# Altium schematic sheet MCU - IMU.SchDoc
size A4; SheetNumber: 5; SheetTotal: 8
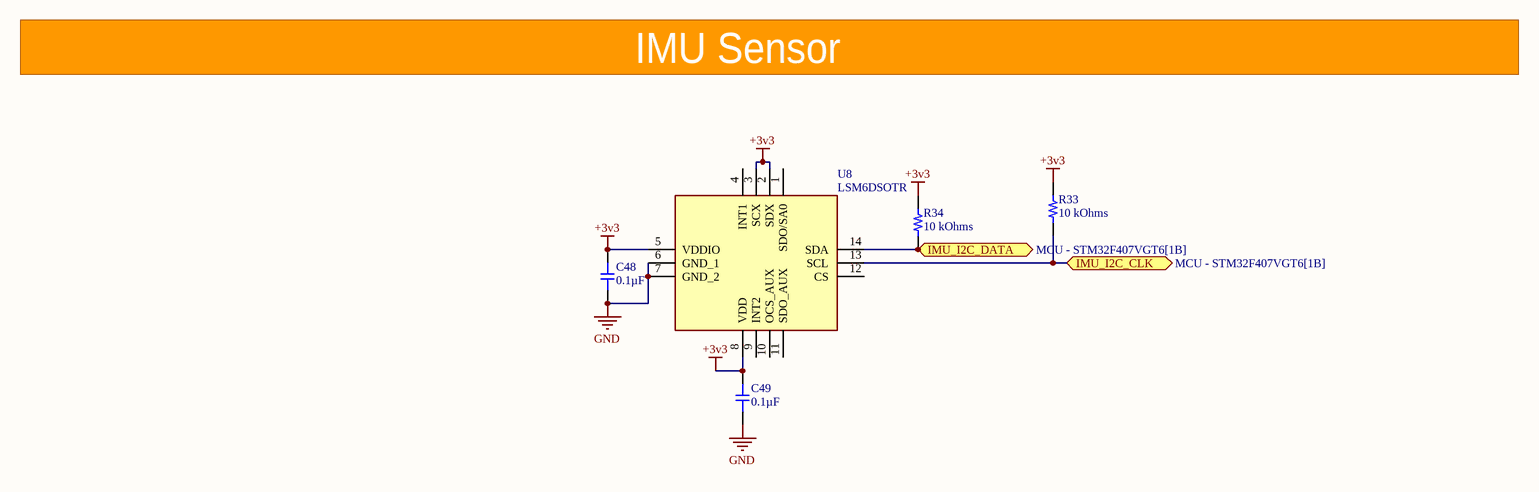
[diagram p0: MCU - IMU.SchDoc]

## Parts
C48  0.1µF  [0603_Footprint]
C49  0.1µF  [0603_Footprint]
R33  10 kOhms  [0603_RES]
R34  10 kOhms  [0603_RES]
U8  LSM6DSOTR  [LGA-14(2.5X3X0.86)]

## Ports
IMU_I2C_CLK (bidir, see MCU - STM32F407VGT6[1B]), IMU_I2C_DATA (bidir, see MCU - STM32F407VGT6[1B])

## Nets
+3v3: C48.1 C49.1 R33.1 R34.2 U8.2(SDX) U8.3(SCX) U8.5(VDDIO) U8.8(VDD)
GND: C48.2 C49.2 U8.6(GND_1) U8.7(GND_2)
IMU_I2C_CLK: R33.2 U8.13(SCL) ; port IMU_I2C_CLK
IMU_I2C_DATA: R34.1 U8.14(SDA) ; port IMU_I2C_DATA

Not connected (* = marked no-connect by the designer): U8 1(SDO/SA0) 4(INT1) 9(INT2) 10(OCS_AUX) 11(SDO_AUX) 12(CS)

## Notes on the sheet
- IMU Sensor

## Library data of the parts
C48 C49 = 0.1uF 0603 Surface Capacitor_1_1_1_1_1_1: 0.1uF 0603 Surface Capacitor
R33 R34 = 10 kOhms 0603
U8 = LSM6DSOTR: Accelerometer; Manufacturer_Name: STMicroelectronics; Datasheet Link: https://www.st.com/resource/en/datasheet/lsm6dso.pdf; Manufacturer_Part_Number: LSM6DSOTR; Mouser Part Number: 511-LSM6DSOTR; Mouser Price/Stock: https://www.mouser.co.uk/ProductDetail/STMicroelectronics/LSM6DSOTR?qs=lc2O%252BfHJPVbD197C5c7oNw%3D%3D; Arrow Part Number: LSM6DSOTR; Arrow Price/Stock: https://www.arrow.com/en/products/lsm6dsotr/stmicroelectronics?region=nac